# EAGLE design stepup-34063 (EAGLE 5.11)
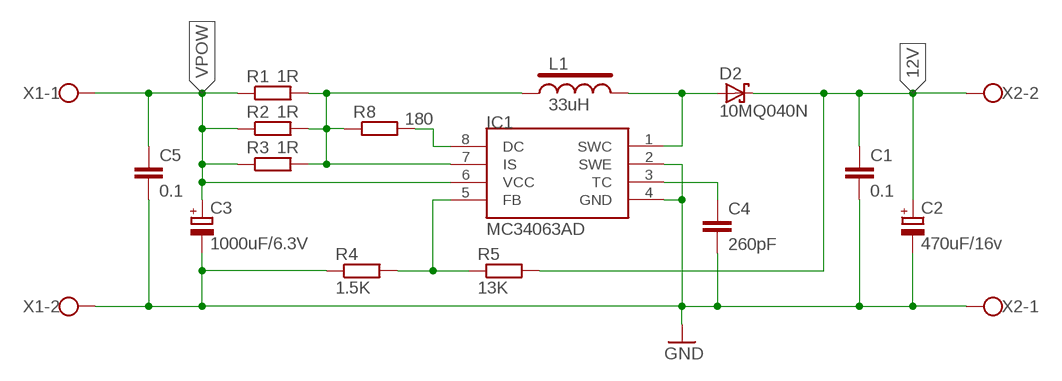
[diagram p0: schematic, sheet 1]

## Parts
C1  0.1  C-C0805  [C0805]
C2  470uF/16v  CPOL-E3.5-8  [E3,5-8]
C3  1000uF/6.3V  CPOL-E3.5-8  [E3,5-8]
C4  260pF  C-C0805  [C0805]
C5  0.1  C-C0805  [C0805]
D2  10MQ040N  SCHOTTKY-SMD  [SMB]
IC1  MC34063AD  [SOIC8]
L1  33uH  LRCH895  [RCH895]
R1  1R  R-R0805  [R0805]
R2  1R  R-R0805  [R0805]
R3  1R  R-R0805  [R0805]
R4  1.5K  R-R0805  [R0805]
R5  13K  R-R0805  [R0805]
R8  180  R-R0805  [R0805]
X1  AK500/2  [AK500/2]
X2  AK500/2  [AK500/2]

## Nets
12V: C1.1 C2.+ D2.C R5.2 X2.2
GND: C1.2 C2.- C3.- C4.2 C5.2 IC1.2(SWE) IC1.4(GND) R4.1 X1.2 X2.1
N$1: C4.1 IC1.3(TC)
N$5: IC1.5(FB) R4.2 R5.1
N$6: IC1.7(IS) L1.1 R1.2 R2.2 R3.2 R8.1
N$9: IC1.8(DC) R8.2
N$10: D2.A IC1.1(SWC) L1.2
VPOW: C3.+ C5.1 IC1.6(VCC) R1.1 R2.1 R3.1 X1.1

## Library data of the parts
C1 C4 C5 = rs485:C-: CAPACITOR, European symbol
C2 C3 = rs485:CPOL-: POLARIZED CAPACITOR, European symbol
D2 = rs485:SCHOTTKY-: Schottky Diode
IC1 = rs485:MC34063: 1.5 A, Step-Up/Down/Inverting Switching Regulator
L1 = rs485:L: Inductors
R1-R5 R8 = rs485:R-: RESISTOR, European symbol
X1 X2 = rs485:AK500/2: CONNECTOR

## Board
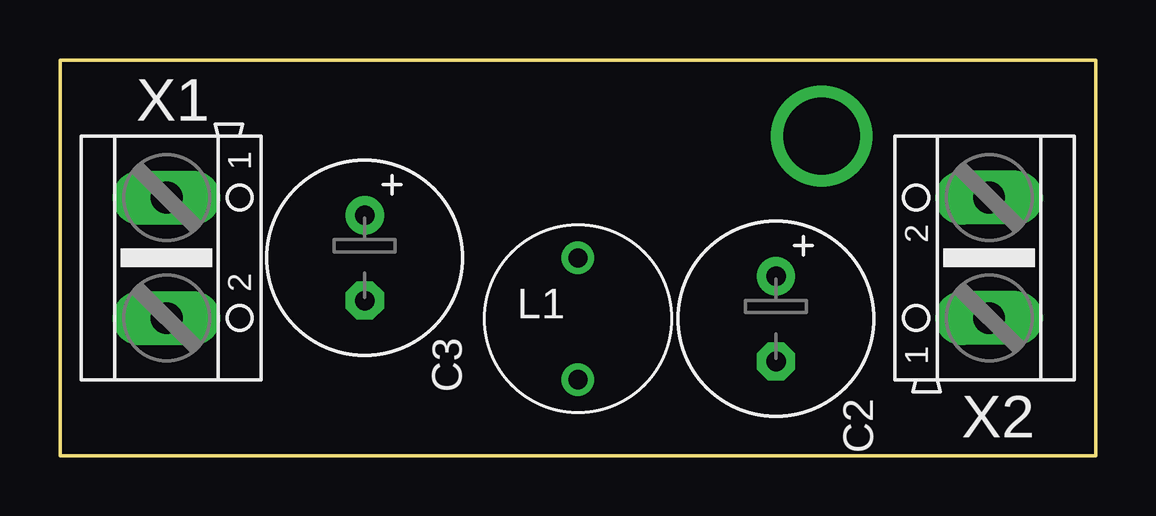
[diagram p1: board, top side]
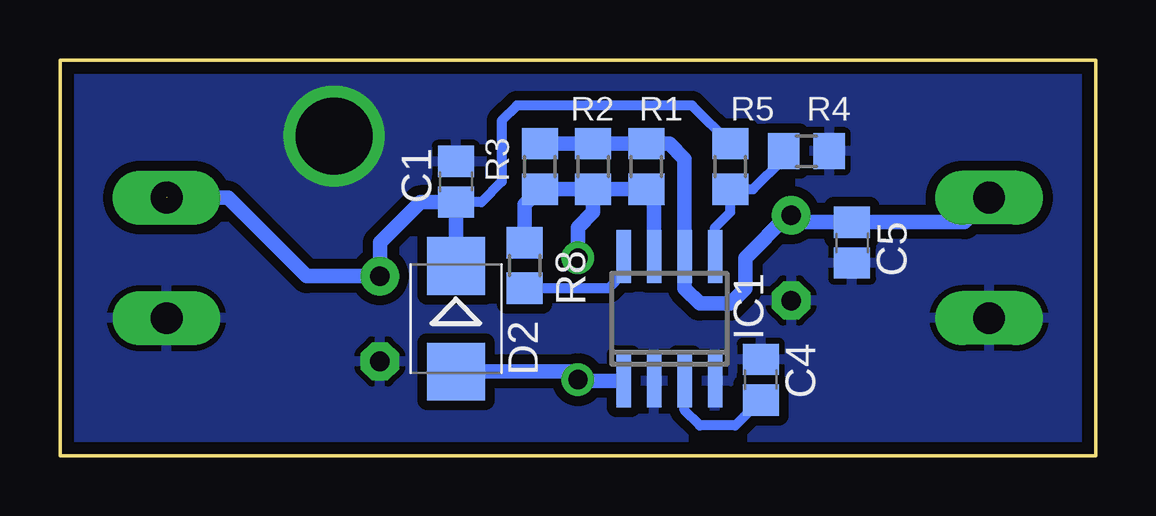
[diagram p2: board, bottom side, seen from below]

Size 43.18 x 16.51 mm. Coordinates in mm from the lower left corner, seen from the top.
Outline: 0,0 43.18,0 43.18,16.51 0,16.51 0,0
Copper layers (1*16): Top 0.035mm / dielectric 1.5mm / Bottom 0.035mm
Design rules "default *": minimum track width 10mil, minimum drill 24mil, track to track 8mil, track to pad 8mil, pad to pad 8mil, via to via 8mil, smd to smd 8mil, copper to edge 0.5mm, drill to drill 8mil, minimum pad ring 10mil, minimum via ring 8mil, stop-mask expansion 4mil, vias tented up to drill 0mil, thermal gap 10mil

### Footprints (pad centres in the part's own frame; a part is rotated, then mirrored left to right if it is on the bottom)
C0805 = smd 1.3 x 1.5: 1 -0.85,0; 2 0.85,0
E3,5-8 = drill 0.813 pad 1.6 round: + -1.778,0 | drill 0.813 pad 1.6 octagon: - 1.778,0
SMB = smd 2.4 x 2.4: A 2.2,0; C -2.2,0
SOIC8 = smd 0.6 x 2.2: 1 -1.905,-2.6; 2 -0.635,-2.6; 3 0.635,-2.6; 4 1.905,-2.6; 5 1.905,2.6; 6 0.635,2.6; 7 -0.635,2.6; 8 -1.905,2.6
RCH895 = drill 0.8 round: 1 0,2.54; 2 0,-2.54
R0805 = smd 1.3 x 1.5: 1 -0.95,0; 2 0.95,0
AK500/2 = drill 1.321 long: 1 -2.515,0; 2 2.515,0

### Placement (x,y rotation side)
C1  26.67,11.43 90 bottom
C2  29.84,5.71 270 top
C3  12.7,8.26 270 top
C4  13.97,3.17 90 bottom
C5  10.16,8.89 270 bottom
D2  26.67,5.71 270 bottom
IC1  17.78,5.71 0 bottom
L1  21.59,5.71 0 top
R1  18.73,12.06 270 bottom
R2  20.95,12.06 270 bottom
R3  23.18,12.06 270 bottom
R4  12.06,12.7 180 bottom
R5  15.24,12.06 90 bottom
R8  23.81,7.94 270 bottom
X1  4.45,8.26 270 top
X2  38.73,8.26 90 top

### Tracks (layer width: path | path; a pad name or v marks a point on that pad's centre or on a via)
12V  (1 unrouted)
  Bottom 0.406: R5.2 16.83,14.61 24.13,14.61 24.77,13.97 24.77,11.43 25.61,10.58 C1.1
  Bottom 0.61: D2.C C1.1 28.16,10.58 29.84,8.89 C2.+ 32.89,7.49 36.17,10.77 38.71,10.77
GND  (via drill 3.2)
  other vias: 31.75,13.34
  pour Bottom (isolate 0.406, rank 5): -1.27,17.78 43.81,17.78 43.81,-1.27 -1.27,-1.27
N$1
  Bottom 0.406: IC1.3 17.14,1.91 16.51,1.27 15.03,1.27 C4.1
N$5
  Bottom 0.406: IC1.5 15.88,9.53 15.24,10.16 R5.1 14.29,11.12 13.02,12.38 R4.2
N$6
  Bottom 0.61: IC1.7 18.41,10.8 R1.2 R2.2 | R2.2 R3.2 23.81,10.48 R8.1 | L1.1 21.59,9.53 20.95,10.16 R2.2
N$9
  Bottom 0.406: R8.2 20.32,6.99 19.68,7.62 IC1.8
N$10
  Bottom 0.61: IC1.1 21.53,3.12 L1.2 21.93,3.52 D2.A
VPOW
  Bottom 0.61: R3.1 R2.1 R1.1 17.78,13.02 17.14,12.38 IC1.6 17.14,6.99 16.51,6.35 15.24,6.35 14.61,6.99 14.61,8.26 12.83,10.03 C3.+ 12.41,9.74 C5.1 5.47,9.74 4.84,10.38 4.75,10.46 X1.1